# EAGLE design zf1 (EAGLE 8.0.1)
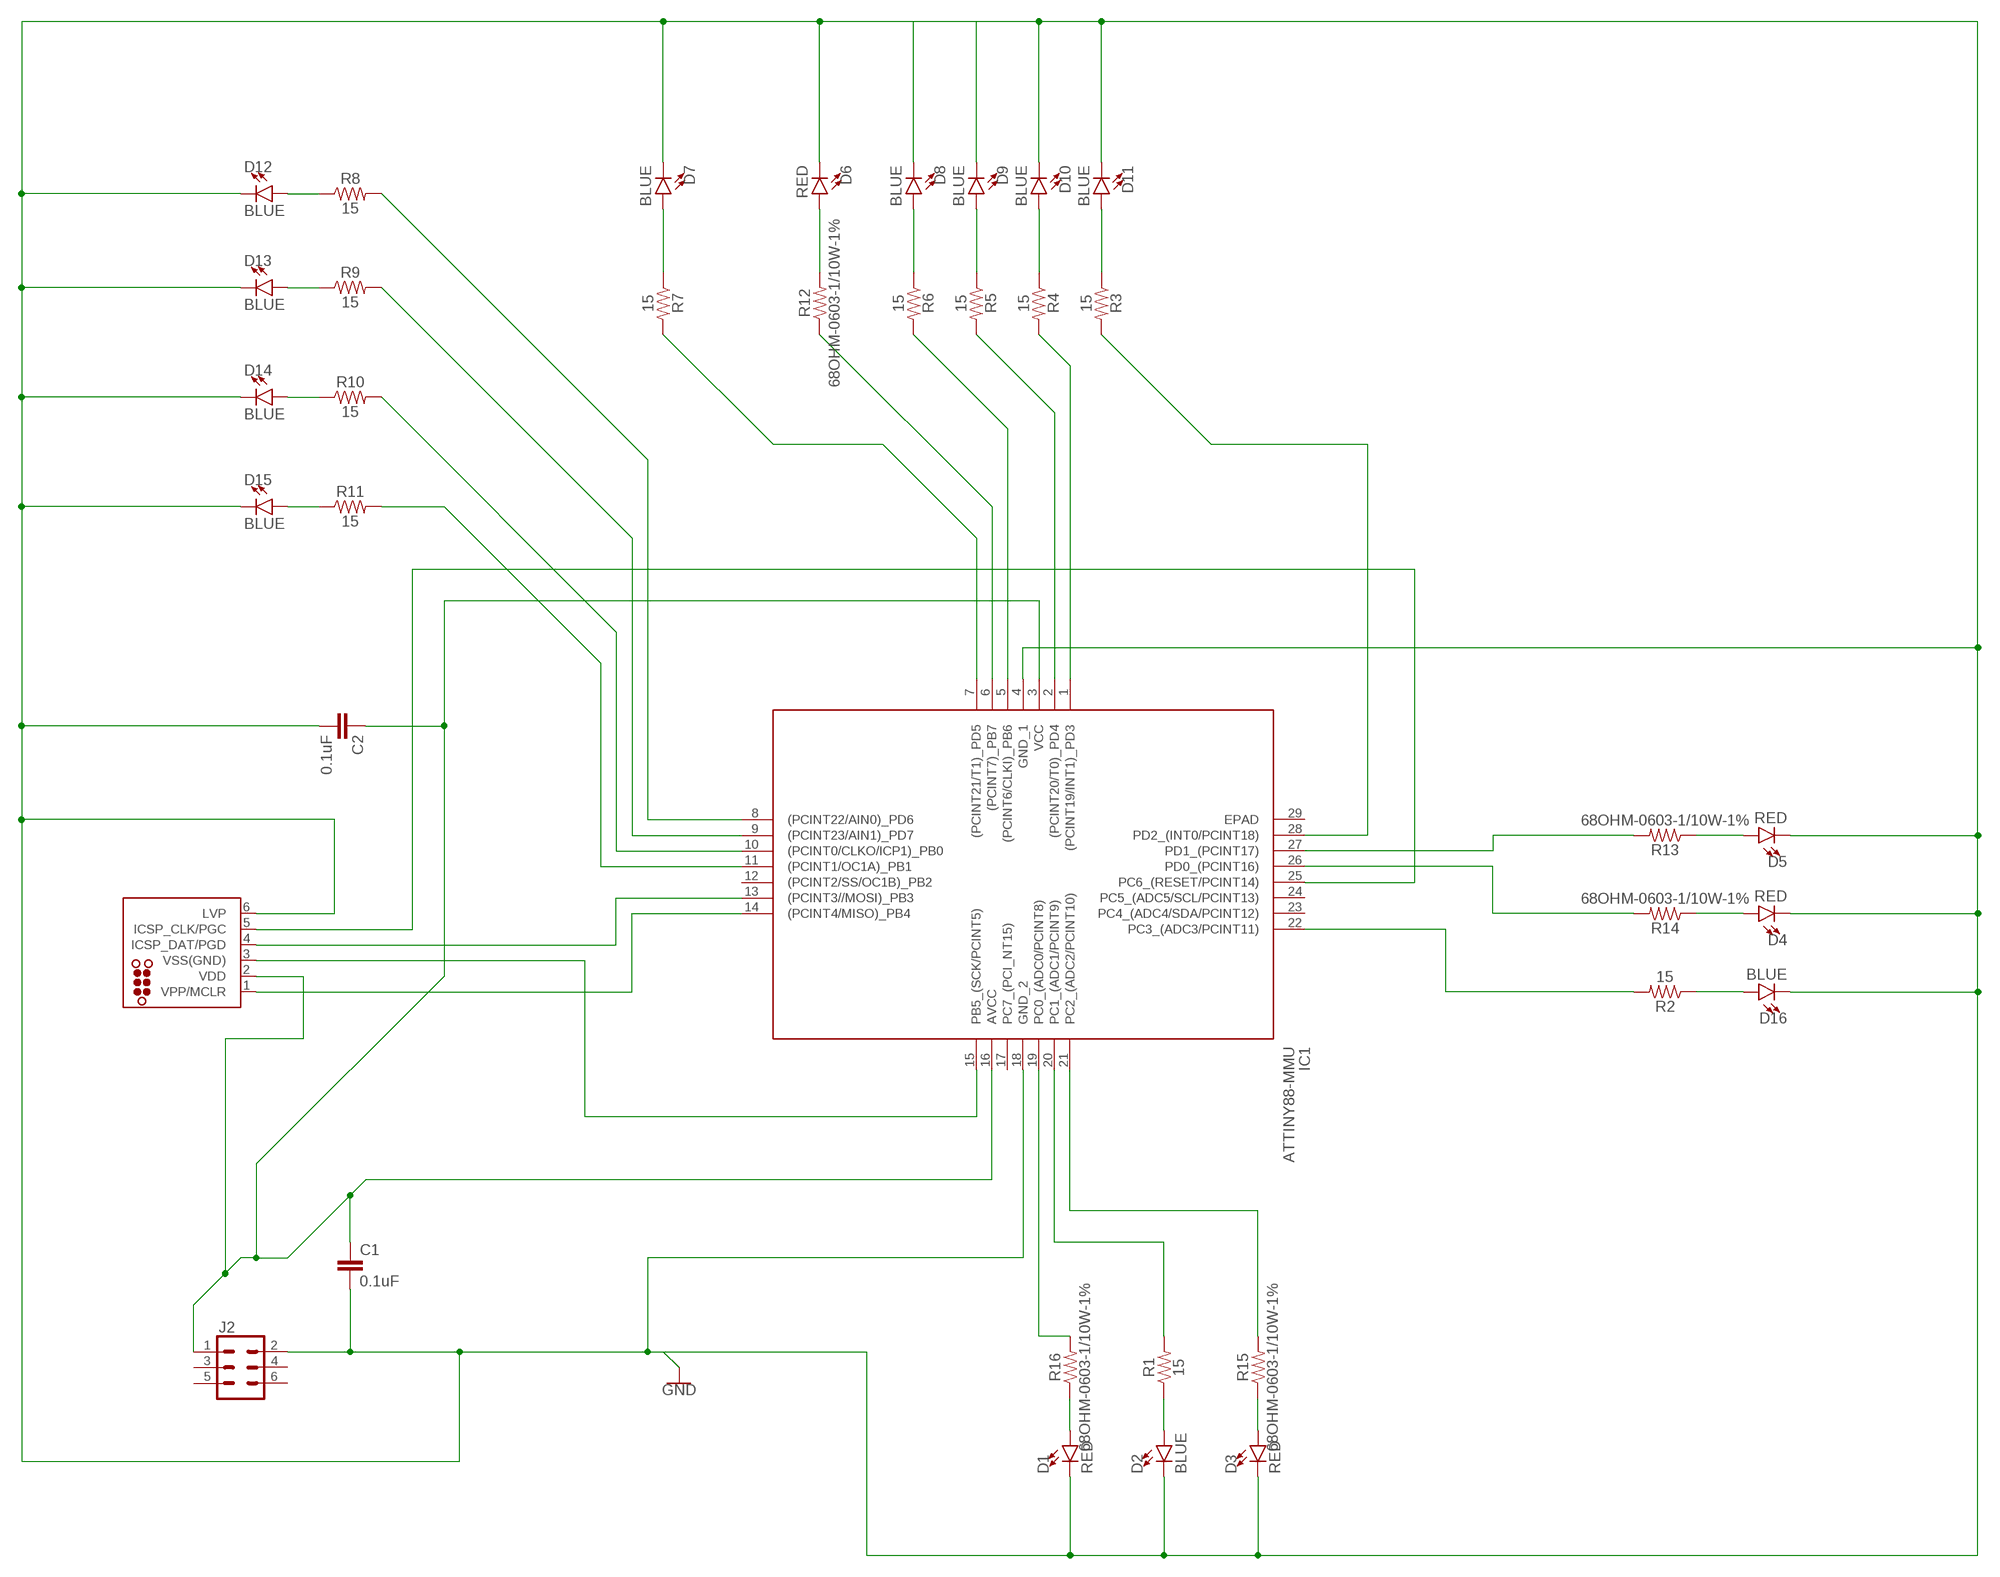
[diagram p0: schematic, sheet 1]

## Parts
C1  0.1uF  0.1UF-0603-25V-(+80/-20%)  [0603]
C2  0.1uF  0.1UF-0603-25V-(+80/-20%)  [0603]
D1  RED  LED-RED0603  [LED-0603]
D2  BLUE  LED-BLUE0603  [LED-0603]
D3  RED  LED-RED0603  [LED-0603]
D4  RED  LED-RED0603  [LED-0603]
D5  RED  LED-RED0603  [LED-0603]
D6  RED  LED-RED0603  [LED-0603]
D7  BLUE  LED-BLUE0603  [LED-0603]
D8  BLUE  LED-BLUE0603  [LED-0603]
D9  BLUE  LED-BLUE0603  [LED-0603]
D10  BLUE  LED-BLUE0603  [LED-0603]
D11  BLUE  LED-BLUE0603  [LED-0603]
D12  BLUE  LED-BLUE0603  [LED-0603]
D13  BLUE  LED-BLUE0603  [LED-0603]
D14  BLUE  LED-BLUE0603  [LED-0603]
D15  BLUE  LED-BLUE0603  [LED-0603]
D16  BLUE  LED-BLUE0603  [LED-0603]
IC1  ATTINY88-MMU  [QFN45P400X400X100-29N]
J1  TC2030-MCP-NL  [TC2030-MCP-NL]
J2  CONN_03X2SHROUD  [2X3-SHROUDED]
R1  15  15OHM-0603-1/10W-1%  [0603]
R2  15  15OHM-0603-1/10W-1%  [0603]
R3  15  15OHM-0603-1/10W-1%  [0603]
R4  15  15OHM-0603-1/10W-1%  [0603]
R5  15  15OHM-0603-1/10W-1%  [0603]
R6  15  15OHM-0603-1/10W-1%  [0603]
R7  15  15OHM-0603-1/10W-1%  [0603]
R8  15  15OHM-0603-1/10W-1%  [0603]
R9  15  15OHM-0603-1/10W-1%  [0603]
R10  15  15OHM-0603-1/10W-1%  [0603]
R11  15  15OHM-0603-1/10W-1%  [0603]
R12  68OHM-0603-1/10W-1%  [0603]
R13  68OHM-0603-1/10W-1%  [0603]
R14  68OHM-0603-1/10W-1%  [0603]
R15  68OHM-0603-1/10W-1%  [0603]
R16  68OHM-0603-1/10W-1%  [0603]

## Nets
GND [GND/3V3]: C1.2 C2.2 D1.C D2.C D3.C D4.C D5.C D6.C D7.C D8.C D9.C D10.C D11.C D12.C D13.C D14.C D15.C D16.C IC1.4(GND_1) IC1.18(GND_2) J1.6(LVP) J2.2
N$1: C1.1 C2.1 IC1.3(VCC) IC1.16(AVCC) J1.2(VDD) J2.1
N$4: D15.A R11.1
N$5: IC1.13((PCINT3//MOSI)_PB3) J1.4(ICSP_DAT/PGD)
N$6: IC1.14((PCINT4/MISO)_PB4) J1.1(VPP/MCLR)
N$7: IC1.15(PB5_(SCK/PCINT5)) J1.3(VSS(GND))
N$8: D14.A R10.1
N$9: IC1.25(PC6_(RESET/PCINT14)) J1.5(ICSP_CLK/PGC)
N$10: D13.A R9.1
N$11: D12.A R8.1
N$12: D7.A R7.1
N$13: D6.A R12.2
N$14: D8.A R6.1
N$15: D9.A R5.1
N$16: D10.A R4.1
N$17: D11.A R3.1
N$18: D5.A R13.1
N$19: D4.A R14.1
N$20: D16.A R2.1
N$21: D3.A R15.1
N$22: D2.A R1.1
N$23: D1.A R16.1
N$24: IC1.19(PC0_(ADC0/PCINT8)) R16.2
N$25: IC1.20(PC1_(ADC1/PCINT9)) R1.2
N$26: IC1.21(PC2_(ADC2/PCINT10)) R15.2
N$27: IC1.22(PC3_(ADC3/PCINT11)) R2.2
N$28: IC1.26(PD0_(PCINT16)) R14.2
N$29: IC1.27(PD1_(PCINT17)) R13.2
N$30: IC1.28(PD2_(INT0/PCINT18)) R3.2
N$31: IC1.1((PCINT19/INT1)_PD3) R4.2
N$32: IC1.2((PCINT20/T0)_PD4) R5.2
N$33: IC1.5((PCINT6/CLKI)_PB6) R6.2
N$34: IC1.6((PCINT7)_PB7) R12.1
N$35: IC1.7((PCINT21/T1)_PD5) R7.2
N$36: IC1.8((PCINT22/AIN0)_PD6) R8.2
N$37: IC1.9((PCINT23/AIN1)_PD7) R9.2
N$38: IC1.10((PCINT0/CLKO/ICP1)_PB0) R10.2
N$39: IC1.11((PCINT1/OC1A)_PB1) R11.2
Unconnected: IC1.12((PCINT2/SS/OC1B)_PB2) IC1.17(PC7_(PCI_NT15)) IC1.23(PC4_(ADC4/SDA/PCINT12)) IC1.24(PC5_(ADC5/SCL/PCINT13)) IC1.29(EPAD) J2.3 J2.4 J2.5 J2.6

## Library data of the parts
C1 C2 = SparkFun-Capacitors:0.1UF: 0.1µF ceramic capacitors A capacitor is a passive two-terminal electrical component used to store electrical energy temporarily in an electric field.; PROD_ID: CAP-00810
D1 D3-D6 = SparkFun-LED:LED-RED: Red SMD LED Used in manufacturing of most products at SparkFun Packages: 0603 - SMD 0603 package [Product Link] <http://docs.avagotech.com/docs/AV02-0551EN> 0603 SMART - SMD 0603 SMART package ( more efficient and expensive)[Product Link] <http://www.osram-os.com/Graphics/XPic2/00077099_0.pdf> 1206 - SMD1206 package [Product Link] <https://www.sparkfun.com/datasheets/DevTools/LilyPad/Q150OVS4.pdff> SparkFun Products: Pro Mini 328 -5V <https://www.sparkfun.com/products/821> RedBoard <https://www.sparkfun.com/products/12757> IOIO-OTG <https://www.sparkfun.com/products/13613>; PROD_ID: DIO-00819
D2 D7-D16 = SparkFun-LED:LED-BLUE: Blue SMD LED Used in manufacturing of various products at SparkFun Packages: 0603 - SMD 0603 package [Product Link] <http://www.digikey.com/product-detail/en/SMLE12BC7TT86/511-1589-2-ND/1641808> 1206 - SMD1206 package [Product Link] <http://www.digikey.com/product-detail/en/lite-on-inc/LTST-C150TBKT/160-1643-1-ND/573584> SparkFun Products: ESP8266 Thing-Dev Board <https://www.sparkfun.com/products/13711> RedBoard <https://www.sparkfun.com/products/12757>; PROD_ID: DIO-08575
IC1 = SamacSys_Parts:ATTINY88-MMU: ATTINY88-MMU, 8 bit AVR Microcontroller 12MHz 8, 64kB, B Flash, 512B RAM, I2C SPI 28-Pin VQFN Source: Datasheet <https://componentsearchengine.com/Datasheets/1/ATTINY88-MMU.pdf>; DESCRIPTION: ATTINY88-MMU, 8 bit AVR Microcontroller 12MHz 8, 64kB, B Flash, 512B RAM, I2C SPI 28-Pin VQFN; HEIGHT: 1mm; MANUFACTURER_NAME: Microchip; MANUFACTURER_PART_NUMBER: ATTINY88-MMU; MOUSER_PART_NUMBER: 556-ATTINY88-MMU; MOUSER_PRICE-STOCK: https://www.mouser.com/Search/Refine.aspx?Keyword=556-ATTINY88-MMU
J1 = tag-connect:TC2030: TAG-CONNECT ICSP Connector Manufacturer: Tag-Connect <http://www.tag-connect.com> Cable for easy In-Circuit Serial Programming. Designed for Microchip ICD2, suitable for many others. Two variants - one "with legs" (for hands-free fit on PCB) and another "without legs" for quick programming. PAD Description 1 MCLR/Vpp 2 Vdd 3 GND 4 PGD (ISPDAT) 5 PGC (ISPCLK) 6 nc (used for LVP) ©2009 ROFA.cz - modified and updated by Robert Darlington ‹rdarlington@gmail.com›
J2 = SparkFun-Connectors:CONN_03X2: Multi connection point. Often used as Generic Header-pin footprint for 0.1 inch spaced/style header connections You can populate with any combo of single row headers, but if you'd like an exact match, check these: Header - 2x3 (Male, 0.1") <https://www.sparkfun.com/products/12807> (PRT-12807) Header - 2x3 (Female, 0.1") <https://www.sparkfun.com/products/13010> (PRT-13010) 2x3 Pin Shrouded Header <https://www.sparkfun.com/products/10877> (PRT-10877) On any of the 0.1 inch spaced packages, you can populate with these: Break Away Headers - Straight <https://www.sparkfun.com/products/116> (PRT-00116) Break Away Male Headers - Right Angle <https://www.sparkfun.com/products/553> (PRT-00553) Female Headers <https://www.sparkfun.com/products/115> (PRT-00115) Break Away Headers - Machine Pin <https://www.sparkfun.com/products/117> (PRT-00117) Break Away Female Headers - Swiss Machine Pin <https://www.sparkfun.com/products/743> (PRT-00743) Special note: the shrouded connector mates well with our 3x2 ribbon cables: Ribbon Crimp Connector - 6-pin (2x3, Female) <https://www.sparkfun.com/products/10651> (PRT-10651) Ribbon Cable - 6 wire (15ft) <https://www.sparkfun.com/products/10646> (PRT-10646); PROD_ID: CONN-10681; SF_ID: PRT_10877
R1-R11 = SparkFun-Resistors:15OHM: 15Ω resistor A resistor is a passive two-terminal electrical component that implements electrical resistance as a circuit element. Resistors act to reduce current flow, and, at the same time, act to lower voltage levels within circuits. - Wikipedia; PROD_ID: RES-12570
R12-R16 = SparkFun-Resistors:68OHM: 68Ω resistor A resistor is a passive two-terminal electrical component that implements electrical resistance as a circuit element. Resistors act to reduce current flow, and, at the same time, act to lower voltage levels within circuits. - Wikipedia

## Net classes
0 default: width 0.3 mm, clearance 0.3 mm
1 FAT: width 0.2 mm, drill 0.4 mm, clearance 0.3 mm
2 GND/3V3: width 0.2 mm, drill 0.4 mm

## Board
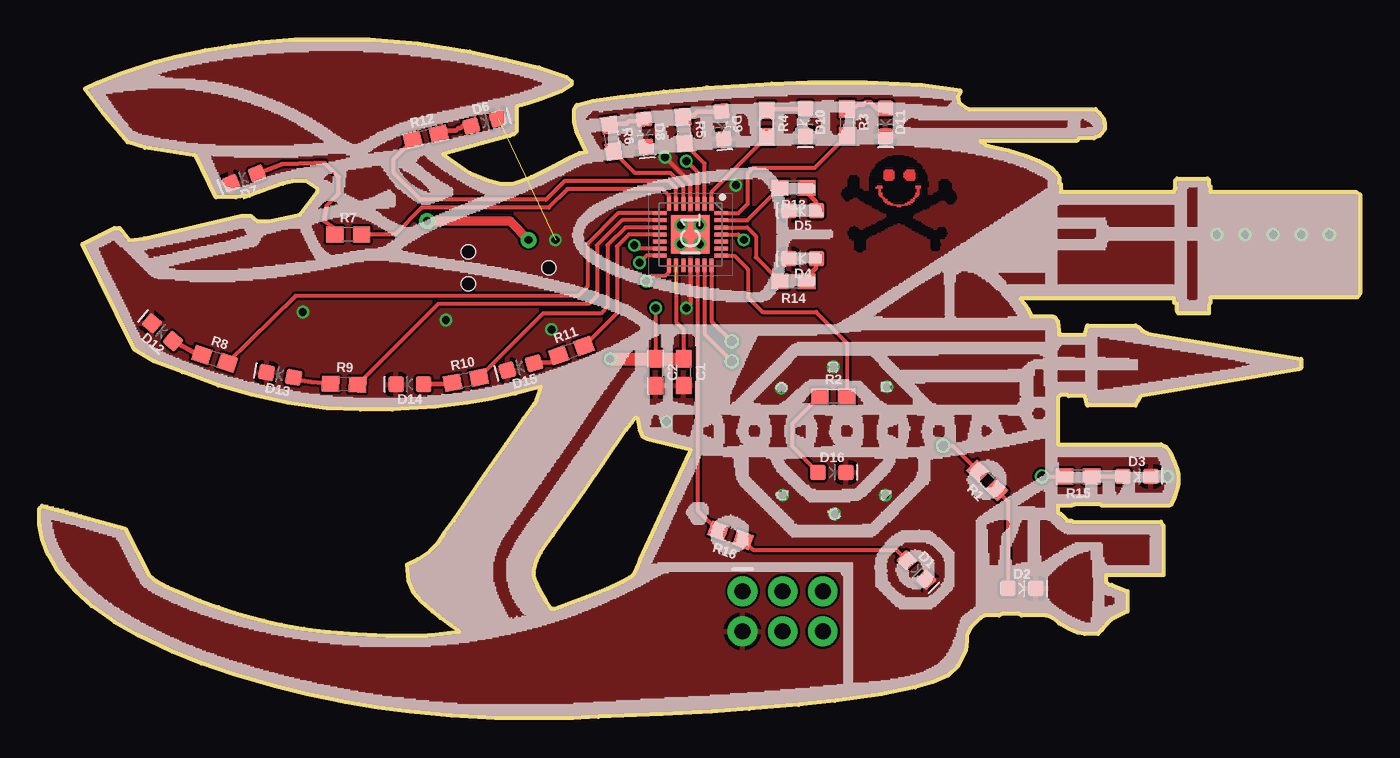
[diagram p1: board, top side]
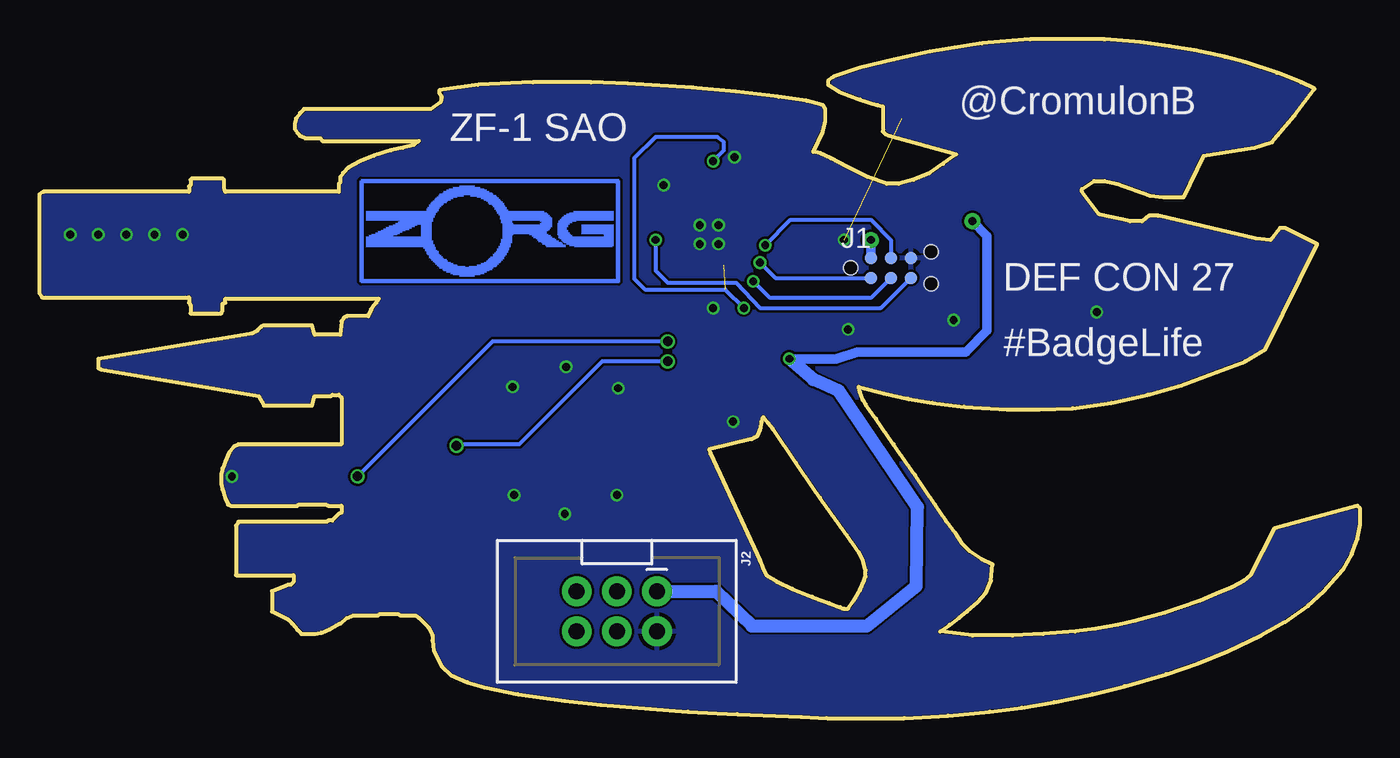
[diagram p2: board, bottom side, seen from below]

Size 83.64 x 43.01 mm. Coordinates in mm from the lower left corner, seen from the top.
Outline: 42.33,39.96 39.53,39.7 36.83,39.37 35.05,39.11 34.03,38.86 33.86,38.6 33.86,37.84 34.03,37.16 34.62,35.89 34.2,35.81 33.52,35.47 32.51,34.96 31.15,34.29 29.97,33.86 29.21,33.86 28.28,34.12 27.26,34.54 26.41,35.13 25.57,35.73 29.8,36.91 30.05,37 30.22,37.16 30.22,38.77 30.56,38.86 31.66,39.2 33.02,39.7 33.69,40.13 33.69,40.38 33.35,40.64 31.66,41.23 29.55,41.74 27.26,42.24 23.96,42.75 20.91,43.01 16.17,43.01 13.88,42.84 12.11,42.58 10.5,42.33 8.55,41.91 7.28,41.57 5.25,40.89 3.72,40.3 2.88,39.87 4.15,38.18 5.25,36.91 5.59,36.49 6.69,36.15 9.9,35.64 11.17,33.02 12.44,33.02 13.29,33.1 15.41,33.86 16.17,34.03 16.85,34.03 17.61,33.52 17.61,33.35 16.51,31.92 14.56,31.49 13.8,31.49 13.38,31.83 12.78,31.83 6.6,30.39 5.67,30.31 5.08,31.07 4.74,31.07 2.71,30.05 6.01,23.37 7.28,22.6 9.06,21.93 11.34,21.08 13.46,20.49 15.75,19.98 18.2,19.64 20.32,19.56 22.35,19.56 25.06,19.73 27.09,19.98 28.61,20.23 30.14,20.57 31.75,20.99 31.66,20.66 31.49,20.15 31.32,19.89 30.65,18.96 29.55,17.35 28.19,15.41 26.92,13.54 26.24,12.53 25.65,11.77 25.23,11.09 24.72,10.58 23.96,10.07 23.28,9.74 23.37,8.72 23.7,7.96 24.21,7.36 24.89,6.77 25.4,6.35 25.99,5.93 26.58,5.5 24.55,5.25 22.01,5.25 20.06,5.33 18.03,5.5 16.76,5.67 15.32,5.93 14.22,6.18 12.36,6.69 11.34,7.03 10.16,7.45 9.14,7.87 8.13,8.3 7.36,8.72 6.94,9.06 5.42,12.02 0.17,13.46 0,13.29 0,12.28 0.17,11.34 0.51,10.41 1.1,9.4 2.29,8.04 3.3,7.11 4.74,6.1 6.26,5.25 8.38,4.23 10.24,3.47 12.27,2.79 14.9,2.03 16.93,1.52 19.39,1.02 21.42,0.68 23.45,0.42 26.07,0.17 28.87,0 33.78,0 35.39,0.08 39.45,0.25 42.58,0.42 44.95,0.59 48.09,0.85 50.37,1.1 53.33,1.52 55.45,1.95 56.55,2.29 57.57,2.71 58.16,3.3 58.67,4.32 58.75,4.91 58.75,5.25 59.01,5.76 59.6,6.35 59.85,6.52 60.78,6.52 60.95,6.6 62.05,6.6 62.22,6.52 63.75,6.52 64.17,6.35 64.59,6.01 65.19,5.67 65.78,5.42 66.2,5.33 67.05,5.33 67.3,5.59 67.64,6.01 67.9,6.26 68.91,6.77 68.91,8.04 67.9,8.47 67.73,8.47 67.56,8.63 67.56,9.06 71.2,9.06 71.2,12.19 71.03,12.44 65.44,12.44 65.36,12.53 65.1,12.53 64.68,12.95 64.51,13.04 64.51,13.46 65.36,13.46 65.52,13.54 67.22,13.54 67.3,13.46 71.54,13.46 71.71,13.54 71.87,13.97 72.04,14.48 72.13,14.81 72.13,15.49 72.04,15.83 71.87,16.25 71.62,16.85 71.37,17.19 71.03,17.35 64.51,17.35 64.51,20.32 64.68,20.49 65.1,20.49 65.19,20.4 66.2,20.4 66.37,19.81 69.42,19.81 69.76,20.4 79.75,22.1 79.92,22.18 79.92,22.77 70.18,24.38 69.84,24.55 69.59,24.8 69.42,24.89 66.37,24.89 66.2,24.3 64.59,24.3 64.51,25.14 64.34,25.4 64.17,25.48 62.82,25.48 62.65,25.91 62.48,26.16 62.31,26.33 62.14,26.58 71.87,26.58 71.87,26.33 72.04,26.24 72.04,25.82 72.13,25.65 74.08,25.65 74.08,26.16 74.16,26.33 74.16,26.67 83.47,26.67 83.64,26.92 83.64,33.19 83.39,33.35 74.16,33.35 74.16,33.69 74.08,33.78 74.08,34.12 73.99,34.2 72.04,34.2 71.96,34.12 71.96,33.61 71.87,33.35 64.68,33.35 64.68,33.86 64.59,33.95 64.59,34.29 64.42,34.54 64.09,34.88 63.32,35.3 62.48,35.64 61.38,35.98 60.61,36.15 59.94,36.32 59.6,36.57 65.69,36.57 65.86,36.74 66.79,36.74 67.13,36.91 67.3,37.08 67.47,37.33 67.47,37.67 67.39,38.01 67.13,38.35 66.88,38.6 58.84,38.6 58.24,39.03 58.16,39.37 58.33,39.62 58.33,39.79 55.87,40.13 52.4,40.3 48.68,40.3 46.39,40.21 42.24,39.96
Outline: 41.23,17.02 41.14,16.76 38.01,9.99 37.84,9.57 37.59,9.06 36.91,8.63 35.98,8.21 34.71,7.7 33.61,7.28 32.93,7.03 32.68,6.94 32.42,6.94 32.08,7.45 31.66,8.13 31.41,8.72 31.32,8.97 31.32,9.4 31.49,9.99 31.75,10.5 32.51,11.6 34.2,13.97 35.73,16.17 37.16,18.29 37.5,18.71 37.76,19.05 37.84,19.05 37.93,18.79 38.01,18.29 38.18,17.86 38.52,17.69 41.23,17.02
Copper layers (1*16): Top 0.035mm / dielectric 1.6mm / Bottom 0.035mm
Design rules "default *": minimum track width 6mil, minimum drill 12mil, track to track 6mil, track to pad 6mil, pad to pad 6mil, via to via 8mil, smd to smd 0mil, copper to edge 1mil, drill to drill 10mil, minimum pad ring 6mil, minimum via ring 6mil, stop-mask expansion 0mil, vias tented up to drill 100mil, thermal gap 10mil
tRestrict: area 51.9,29.5 to 52.1,29.6; area 51.7,29.6 to 52.2,29.7; area 56.5,29.6 to 56.9,29.7; area 51.6,29.7 to 52.4,29.8; area 56.5,29.7 to 57,29.8; area 51.6,29.8 to 52.4,29.8; area 56.4,29.8 to 57,29.8; area 51.6,29.8 to 52.4,29.9; area 56.4,29.8 to 57,29.9; area 51.6,29.9 to 52.4,30; area 56.4,29.9 to 57.1,30; area 51.6,30 to 52.4,30.1; area 56.4,30 to 57.1,30.1; area 51.6,30.1 to 52.4,30.2; area 56.4,30.1 to 57,30.2; area 51.7,30.2 to 52.3,30.3; area 56.4,30.2 to 57,30.3; area 51.4,30.3 to 52.3,30.4; area 56.4,30.3 to 57,30.4; area 51.3,30.4 to 52.4,30.4; area 56.3,30.4 to 57.4,30.4; area 51.3,30.4 to 52.5,30.5; area 56.2,30.4 to 57.4,30.5; area 51.3,30.5 to 52.7,30.6; area 56,30.5 to 57.4,30.6; area 51.2,30.6 to 53,30.7; area 55.8,30.6 to 57.4,30.7; area 51.2,30.7 to 53,30.8; area 55.7,30.7 to 57.5,30.8; area 51.2,30.8 to 53.3,30.9; area 55.5,30.8 to 57.4,30.9; area 51.3,30.9 to 51.9,30.9; area 52.1,30.9 to 53.5,30.9; area 55.3,30.9 to 56.7,30.9; area 56.8,30.9 to 57.4,30.9; area 51.3,30.9 to 51.9,31; area 52.2,30.9 to 53.5,31; area 55.2,30.9 to 56.6,31; area 56.8,30.9 to 57.4,31; area 51.3,31 to 51.9,31.1; area 52.4,31 to 53.7,31.1; area 55.1,31 to 56.4,31.1; area 56.9,31 to 57.4,31.1; area 51.5,31.1 to 51.7,31.2; area 52.5,31.1 to 53.9,31.2; area 54.9,31.1 to 56.3,31.2; area 52.7,31.2 to 54.1,31.3; area 54.8,31.2 to 56.1,31.3; area 53,31.3 to 54.3,31.4; area 54.6,31.3 to 55.9,31.4; area 53,31.4 to 54.3,31.5; area 54.5,31.4 to 55.8,31.5; area 53.2,31.5 to 54.1,31.5; area 54.4,31.5 to 55.7,31.5; area 53.4,31.5 to 54,31.6; area 54.1,31.5 to 55.5,31.6; area 53.5,31.6 to 53.8,31.7; area 54.1,31.6 to 55.3,31.7; area 53.9,31.7 to 55.2,31.8; area 53.7,31.8 to 55,31.9; area 53.6,31.9 to 55,32; area 55.2,31.9 to 55.4,32; area 53.5,32 to 55.6,32; area 53.3,32 to 55.7,32.1; area 53.1,32.1 to 55.9,32.2; area 53,32.2 to 56.2,32.3; area 52.8,32.3 to 56.3,32.4; area 52.7,32.4 to 54.3,32.5; area 54.6,32.4 to 56.4,32.5; area 52.5,32.5 to 53.9,32.6; area 55,32.5 to 56.6,32.6; area 52.4,32.6 to 53.7,32.6; area 54.1,32.6 to 54.8,32.6; area 55.2,32.6 to 56.8,32.6; area 57.5,32.6 to 57.9,32.6; area 52.2,32.6 to 53.5,32.7; area 53.9,32.6 to 55,32.7; area 55.3,32.6 to 56.9,32.7; area 57.4,32.6 to 58,32.7; area 51.1,32.7 to 51.3,32.8; area 52,32.7 to 53.5,32.8; area 53.7,32.7 to 55.2,32.8; area 55.4,32.7 to 57.1,32.8; area 57.4,32.7 to 58,32.8; area 51,32.8 to 51.3,32.9; area 51.9,32.8 to 53.5,32.9; area 53.7,32.8 to 55.2,32.9; area 55.4,32.8 to 57.3,32.9; area 57.4,32.8 to 58,32.9; area 50.9,32.9 to 51.5,33; area 51.9,32.9 to 53.4,33; area 53.5,32.9 to 55.3,33; area 55.5,32.9 to 58.1,33; area 50.8,33 to 51.5,33.1; area 51.6,33 to 53.3,33.1; area 53.5,33 to 55.4,33.1; area 55.6,33 to 56.2,33.1; area 56.3,33 to 58.1,33.1; area 50.8,33.1 to 53.2,33.1; area 53.4,33.1 to 55.4,33.1; area 55.7,33.1 to 56.2,33.1; area 56.4,33.1 to 58.1,33.1; area 50.8,33.1 to 53.1,33.2; area 53.4,33.1 to 55.5,33.2; area 55.7,33.1 to 56.3,33.2; area 56.6,33.1 to 58,33.2; area 50.8,33.2 to 53.1,33.3; area 53.4,33.2 to 55.5,33.3; area 55.7,33.2 to 56.3,33.3; area 56.7,33.2 to 58,33.3; area 50.8,33.3 to 52.4,33.4; area 52.5,33.3 to 53.1,33.4; area 53.3,33.3 to 55.6,33.4; area 55.7,33.3 to 56.3,33.4; area 56.8,33.3 to 58,33.4; area 50.8,33.4 to 52.2,33.5; area 52.5,33.4 to 53.1,33.5; area 53.3,33.4 to 55.6,33.5; area 55.7,33.4 to 56.3,33.5; area 57,33.4 to 57.9,33.5; area 50.9,33.5 to 52.1,33.6; area 52.5,33.5 to 53.1,33.6; area 53.3,33.5 to 55.6,33.6; area 55.7,33.5 to 56.3,33.6; area 57,33.5 to 57.6,33.6; area 51,33.6 to 51.9,33.7; area 52.5,33.6 to 53,33.7; area 53.4,33.6 to 55.5,33.7; area 55.8,33.6 to 56.3,33.7; area 56.9,33.6 to 57.7,33.7; area 51.3,33.7 to 51.9,33.7; area 52.5,33.7 to 53,33.7; area 53.4,33.7 to 55.5,33.7; area 55.8,33.7 to 56.3,33.7; area 56.9,33.7 to 57.8,33.7; area 51.2,33.7 to 51.9,33.8; area 52.5,33.7 to 56.3,33.8; area 56.9,33.7 to 57.8,33.8; area 51.2,33.8 to 51.9,33.9; area 52.5,33.8 to 56.3,33.9; area 56.9,33.8 to 57.8,33.9; area 51.2,33.9 to 51.9,34; area 52.5,33.9 to 56.3,34; area 56.9,33.9 to 57.7,34; area 51.2,34 to 51.9,34.1; area 52.5,34 to 56.3,34.1; area 57,34 to 57.6,34.1; area 51.2,34.1 to 51.9,34.2; area 52.5,34.1 to 53.5,34.2; area 54.1,34.1 to 54.9,34.2; area 55.4,34.1 to 56.3,34.2; area 57.1,34.1 to 57.5,34.2; area 51.3,34.2 to 51.9,34.2; area 52.5,34.2 to 53.5,34.2; area 54.1,34.2 to 54.8,34.2; area 55.5,34.2 to 56.3,34.2; area 51.3,34.2 to 51.9,34.3; area 52.5,34.2 to 53.5,34.3; area 54.1,34.2 to 54.7,34.3; area 55.5,34.2 to 56.3,34.3; area 51.3,34.3 to 51.8,34.4; area 52.6,34.3 to 53.5,34.4; area 54.1,34.3 to 54.7,34.4; area 55.5,34.3 to 56.3,34.4; area 52.6,34.4 to 53.5,34.5; area 54.1,34.4 to 54.7,34.5; area 55.5,34.4 to 56.2,34.5; area 52.6,34.5 to 53.5,34.6; area 54.1,34.5 to 54.7,34.6; area 55.5,34.5 to 56.2,34.6; area 52.7,34.6 to 53.5,34.7; area 54.1,34.6 to 54.8,34.7; area 55.4,34.6 to 56.1,34.7; area 52.7,34.7 to 53.5,34.8; area 54.1,34.7 to 54.9,34.8; area 55.4,34.7 to 56.1,34.8; area 52.8,34.8 to 56,34.8; area 52.9,34.8 to 55.9,34.9; area 53,34.9 to 55.9,35; area 53,35 to 55.8,35.1; area 53,35.1 to 55.7,35.2; area 53.1,35.2 to 55.6,35.3; area 53.3,35.3 to 55.6,35.3; area 53.4,35.3 to 55.4,35.4; area 53.5,35.4 to 55.3,35.5; area 53.7,35.5 to 55.1,35.6; area 54.1,35.6 to 54.7,35.7

### Footprints (pad centres in the part's own frame; a part is rotated, then mirrored left to right if it is on the bottom)
0603 = smd 1.1 x 1: 1 -0.85,0; 2 0.85,0
LED-0603 = smd 1 x 1: A -0.877,0; C 0.877,0
QFN45P400X400X100-29N = smd 0.85 x 0.25: 1 -1.95,1.35; 2 -1.95,0.9; 3 -1.95,0.45; 4 -1.95,0; 5 -1.95,-0.45; 6 -1.95,-0.9; 7 -1.95,-1.35; 15 1.95,-1.35; 16 1.95,-0.9; 17 1.95,-0.45; 18 1.95,0; 19 1.95,0.45; 20 1.95,0.9; 21 1.95,1.35 | smd 0.25 x 0.85: 8 -1.35,-1.95; 9 -0.9,-1.95; 10 -0.45,-1.95; 11 0,-1.95; 12 0.45,-1.95; 13 0.9,-1.95; 14 1.35,-1.95; 22 1.35,1.95; 23 0.9,1.95; 24 0.45,1.95; 25 0,1.95; 26 -0.45,1.95; 27 -0.9,1.95; 28 -1.35,1.95 | smd 2.45 x 2.45: 29 0,0
TC2030-MCP-NL = smd 0.787 x 0.787: 1 1.27,-0.635; 2 1.27,0.635; 3 2.54,-0.635; 4 2.54,0.635; 5 3.81,-0.635; 6 3.81,0.635 | hole 0.889: 0,0; 5.08,-1.016; 5.08,1.016
2X3-SHROUDED = drill 1.016 pad 1.88: 1 -1.27,2.54; 2 1.27,2.54; 3 -1.27,0; 4 1.27,0; 5 -1.27,-2.54; 6 1.27,-2.54

### Placement (x,y rotation side)
C1  40.81,21.93 270 top
C2  39.02,21.92 270 top
D1  55.54,9.39 315 top
D2  62.22,8.22 0 top
D3  69.5,15.33 0 top
D4  48.34,29.12 180 top
D5  48.34,32.17 180 top
D6  28.19,37.76 15 top
D7  12.96,34.2 200 top
D8  38.35,37.08 275 top
D9  43.26,37.59 275 top
D10  48.51,37.76 270 top
D11  53.59,37.76 270 top
D12  7.79,24.46 140 top
D13  15.24,21.75 170 top
D14  23.45,21.16 180 top
D15  30.48,22.26 195 top
D16  50.2,15.58 0 top
IC1  41.23,30.65 270 top
J1  32.25,28.53 0 bottom
J2  47.07,6.77 270 bottom
R1  60.03,15.07 135 top
R2  50.28,20.41 0 top
R3  51.14,37.76 270 top
R4  46.06,37.67 270 top
R5  40.81,37.25 274 top
R6  36.24,36.74 278 top
R7  19.55,30.65 0 top
R8  11.09,22.78 342 top
R9  19.3,21.17 358 top
R10  27,21.42 11 top
R11  33.69,23.28 20 top
R12  24.46,36.83 13 top
R13  47.75,33.61 180 top
R14  47.75,27.68 180 top
R15  65.78,15.32 180 top
R16  43.77,11.6 160 top

### Tracks (layer width: path | path; a pad name or v marks a point on that pad's centre or on a via)
GND  (via drill 0.5, 0.5 pad 0.25)  (1 unrouted)
  Top 0.2: D9.C 43.33,36.78 43.23,36.8
  Top 0.254: IC1.18 41.23,26.24 v40.97,25.99 | IC1.4 41.23,33.95 v39.62,35.56
  other vias: 74.58,30.65 76.36,30.65 78.14,30.65 79.92,30.65 81.7,30.65 71.45,15.32 53.59,14.14 50.37,12.95 47.07,14.14 46.99,20.91 50.29,22.27 53.67,21 40.64,30.05 41.82,30.05 41.82,31.24 40.64,31.24 32.68,30.31 16.68,25.74 25.74,25.23 32.42,24.64 44.11,33.78 39.7,18.79
  pour Top (rank 6): -3.39,47.07 86.61,46.82 86.77,-3.47 -4.91,-3.3 -4.23,47.07
  pour Bottom (rank 6): -4.4,47.75 87.45,47.66 87.37,-4.83 -6.01,-4.23 -4.74,47.75
N$1  (via drill 0.5, 0.5 pad 0.25, 0.5 pad 1.02)  (1 unrouted)
  Top 0.254: IC1.3 41.68,34.6 v40.97,35.3 | IC1.16 40.33,25.11 40.8,24.64 40.81,24.64 C1.1 | v39.03,25.99 v39.02,25.99 C2.1
  Top 0.61: v24.55,31.49 29.8,31.49 v30.98,30.31
  Top 0.813: v36.15,22.77 C1.1
  Bottom 0.254: v40.97,35.3 40.3,35.98 40.3,36.49 40.72,36.83 44.61,36.83 45.97,35.47 45.97,27.85 45.29,27.17 40.21,27.17 v39.03,25.99
  Bottom 0.3: J1.2 31.03,29.28
  Bottom 0.61: v36.15,22.77 33.19,22.77 31.83,23.2 24.97,23.2 23.62,24.55 23.62,30.56 v24.55,31.49 | v30.98,30.31 J1.2
  Bottom 0.813: J2.1 40.81,8.04 38.52,5.84 31.24,5.84 28.11,8.38 28.02,13.38 33.02,20.74 34.62,21.46 v36.15,22.77
N$4
  Top 0.3: D15.A 31.33,22.53 32.38,22.53 32.83,22.98 R11.1
N$5  (via drill 0.5 pad 0.25)
  Top 0.254: IC1.13 37.89,29.75 v37.67,29.97
  Bottom 0.254: v37.67,29.97 36.06,31.58 30.98,31.58 29.71,30.31 J1.4
N$6  (via drill 0.5 pad 0.25)
  Top 0.254: IC1.14 38.44,29.3 v38.01,28.87
  Bottom 0.254: v38.01,28.87 37.04,27.89 J1.1
N$7  (via drill 0.5 pad 0.25)
  Top 0.254: IC1.15 39.88,28.28 39.62,28.02 38.77,28.02 v38.43,27.68
  Bottom 0.254: v38.43,27.68 37.42,26.67 30.94,26.67 J1.3
N$8
  Top 0.3: D14.A 24.43,21.18 26.08,21.18 R10.1
N$9  (via drill 0.5 pad 0.25)
  Top 0.254: IC1.25 44.27,30.65 v44.61,30.31
  Bottom 0.254: v44.61,30.31 44.61,28.36 43.85,27.6 39.53,27.6 38.01,25.99 30.35,25.99 J1.5
N$10
  Top 0.3: D13.A 16.18,21.46 17.21,21.29 17.93,21.25 18.43,21.33 R9.1
N$11
  Top 0.3: D12.A 8.53,23.88 8.81,23.71 9.73,23.22 10.18,23.13 R8.1
N$12
  Top 0.254: 18.18,32.46 18.96,33.25 18.96,34.29 18.07,35.18 17.45,35.18
  Top 0.3: 17.45,35.18 15.38,35.09 14.14,34.62 13.93,34.53 D7.A | 18.18,32.46 18.03,31.51 18.88,30.93 18.73,30.78 R7.1
N$13
  Top 0.3: D6.A 27.28,37.53 26.83,37.53 26.68,37.38 26.53,37.38 26.38,37.23 25.48,37.23 25.33,37.08 R12.2
N$14
  Top 0.3: D8.A 38.23,37.83 37.33,37.83 37.18,37.68 36.13,37.68 R6.1
N$15
  Top 0.3: D9.A 43.18,38.43 41.68,38.43 41.38,38.13 41.23,38.28 40.93,38.28 40.78,38.13 R5.1
N$16
  Top 0.3: D10.A 48.43,38.58 46.18,38.58 R4.1
N$17
  Top 0.3: D11.A 53.53,38.58 53.08,38.58 52.63,39.03 52.33,39.03 52.18,38.88 51.88,38.88 51.73,38.73 51.28,38.73 R3.1
N$18
  Top 0.3: D5.A 49.18,32.28 49.18,32.73 48.73,33.18 48.73,33.48 R13.1
N$19
  Top 0.3: D4.A 49.18,28.98 49.18,28.53 48.73,28.08 48.73,27.78 R14.1
N$20
  Top 0.254: R2.1 47.66,18.63 47.66,17.24 D16.A
  Top 0.3: 49.63,20.13 49.48,20.28 R2.1 | D16.A 49.33,15.63
N$21
  Top 0.3: D3.A 68.53,15.33 66.73,15.33 R15.1
N$22
  Top 0.254: R1.1 61.34,13.75 D2.A
N$23
  Top 0.254: R16.1 45.21,10.67 54.26,10.67 D1.A
N$24
  Top 0.254: IC1.19 41.68,13.18 R16.2
N$25  (via drill 0.6 pad 0.25)
  Top 0.254: IC1.20 42.13,24.33 v43.85,22.6 | v57.23,17.27 57.82,17.27 R1.2
  Bottom 0.254: v43.85,22.6 48,22.6 53.25,17.35 57.14,17.35 v57.23,17.27
N$26  (via drill 0.6 pad 0.25)
  Top 0.254: IC1.21 42.58,25.15 v43.85,23.87 | v63.49,15.32 R15.2
  Bottom 0.254: v43.85,23.87 54.94,23.87 v63.49,15.32
N$27
  Top 0.254: IC1.22 44.01,29.3 44.87,28.44 44.87,26.67 45.8,25.74 49.19,25.74 51.13,23.79 R2.2
N$28
  Top 0.254: IC1.26 44.84,31.1 45.38,30.56 45.38,29.2 R14.2
N$29
  Top 0.254: IC1.27 44.84,31.55 R13.2
N$30
  Top 0.254: IC1.28 44.27,32 44.87,32.59 44.87,34.54 45.21,34.88 49.1,34.88 R3.2
N$31
  Top 0.254: IC1.1 42.58,33.35 R4.2
N$32
  Top 0.254: IC1.2 42.13,35.14 R5.2
N$33
  Top 0.254: IC1.5 40.78,33.72 39.96,34.54 37.72,34.54 R6.2
N$34
  Top 0.254: IC1.6 40.33,33.58 39.87,34.03 33.27,34.03 32.08,32.85 24.13,32.85 22.43,34.54 22.43,35.44 R12.1
N$35
  Top 0.254: IC1.7 39.88,33.1 39.45,33.52 33.44,33.52 32.25,32.34 24.21,32.34 22.52,30.65 R7.2
N$36
  Top 0.254: IC1.8 36.65,32 34.71,30.05 34.71,27.34 34.12,26.75 16.22,26.75 R8.2
N$37
  Top 0.254: IC1.9 36.88,31.55 35.3,29.97 35.3,26.75 34.79,26.24 25.25,26.24 R9.2
N$38
  Top 0.254: IC1.10 37.11,31.1 35.98,29.97 35.98,26.07 35.56,25.65 31.9,25.65 R10.2
N$39
  Top 0.254: IC1.11 37.34,30.65 36.57,29.88 36.57,25.66 R11.2
(copper drawn outside any net)
  shapes: Bottom area x330, Top area x46

### Text on the board
bPlace: @CromulonB | ZF-1 SAO | DEF CON 27 | #BadgeLife